# Altium project Extension board.PrjPcb
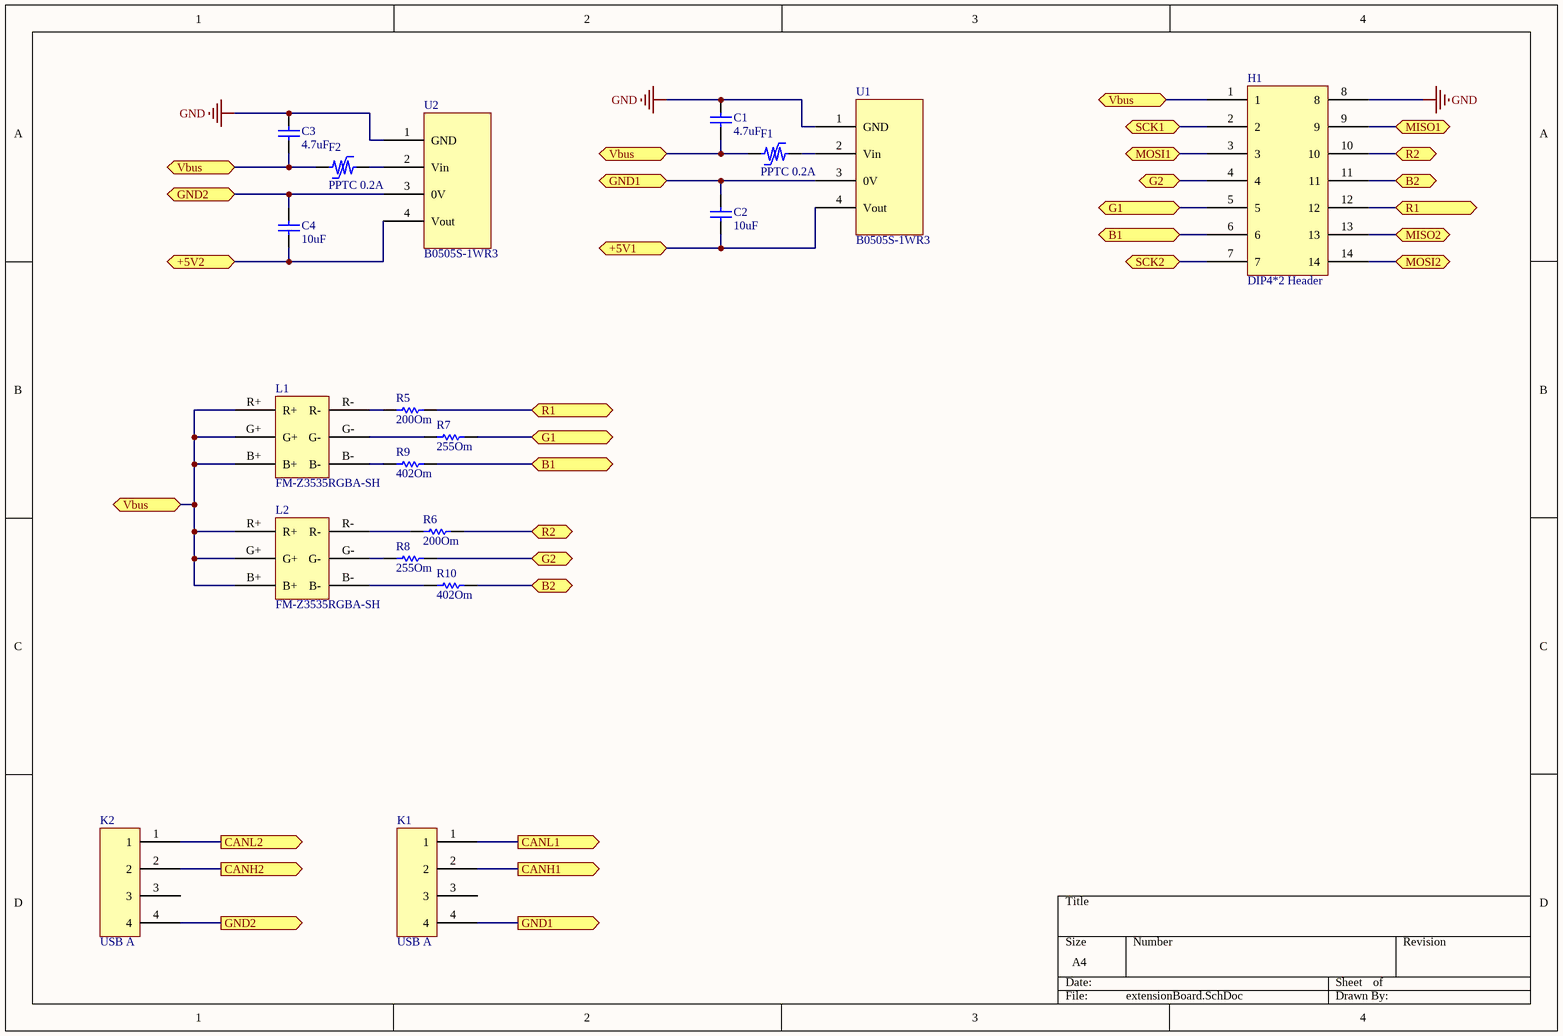
[diagram p0: extensionBoard.SchDoc]
2 sheets, 35 parts. Net scope: flat (ports and power ports of the same name join across sheets).
Board file: board.PcbDoc
Sheets:
  extensionBoard.SchDoc
  logic.SchDoc

## Sheet extensionBoard.SchDoc
size A4

### Parts
C1  4.7uF  [CAPC1608X90X35ML10T15]
C2  10uF  [CAPC1608X90X35ML10T15]
C3  4.7uF  [CAPC1608X90X35ML10T15]
C4  10uF  [CAPC1608X90X35ML10T15]
F1  PPTC 0.2A  [PTC 0603]
F2  PPTC 0.2A  [PTC 0603]
H1  DIP4*2 Header  [DIP7*2]
K1  USB A  [USB A]
K2  USB A  [USB A]
L1  FM-Z3535RGBA-SH  [Z3535RGBA]
L2  FM-Z3535RGBA-SH  [Z3535RGBA]
R5  200Om  [RESC1608X55X30ML20T10]
R6  200Om  [RESC1608X55X30ML20T10]
R7  255Om  [RESC1608X55X30ML20T10]
R8  255Om  [RESC1608X55X30ML20T10]
R9  402Om  [RESC1608X55X30ML20T10]
R10  402Om  [RESC1608X55X30ML20T10]
U1  B0505S-1WR3  [Dip4 package]
U2  B0505S-1WR3  [Dip4 package]

### Ports
+5V1 (bidir), +5V2 (bidir), B1 (bidir), B2 (bidir), CANH1 (out), CANH2 (out), CANL1 (out), CANL2 (out), G1 (bidir), G2 (bidir), GND1 (bidir), GND1 (out), GND2 (bidir), GND2 (out), MISO1 (bidir), MISO2 (bidir), MOSI1 (bidir), MOSI2 (bidir), R1 (bidir), R2 (bidir), SCK1 (bidir), SCK2 (bidir), Vbus (bidir)

### Nets
GND: C1.2 C3.2 H1.8 U1.1(GND) U2.1(GND)
NetC1_1: C1.1 C3.1 F1.1 F2.1 H1.1 L1.B+ L1.G+ L1.R+ L2.B+ L2.G+ L2.R+ ; port Vbus
NetC2_1: C2.1 U1.4(Vout) ; port +5V1
NetC2_2: C2.2 K1.4 U1.3(0V) ; port GND1
NetC4_1: C4.1 U2.4(Vout) ; port +5V2
NetC4_2: C4.2 K2.4 U2.3(0V) ; port GND2
NetF1_2: F1.2 U1.2(Vin)
NetF2_2: F2.2 U2.2(Vin)
NetH1_2: H1.2 ; port SCK1
NetH1_3: H1.3 ; port MOSI1
NetH1_4: H1.4 R8.2 ; port G2
NetH1_5: H1.5 R7.2 ; port G1
NetH1_6: H1.6 R9.2 ; port B1
NetH1_7: H1.7 ; port SCK2
NetH1_9: H1.9 ; port MISO1
NetH1_10: H1.10 R6.2 ; port R2
NetH1_11: H1.11 R10.2 ; port B2
NetH1_12: H1.12 R5.2 ; port R1
NetH1_13: H1.13 ; port MISO2
NetH1_14: H1.14 ; port MOSI2
NetK1_1: K1.1 ; port CANL1
NetK1_2: K1.2 ; port CANH1
NetK2_1: K2.1 ; port CANL2
NetK2_2: K2.2 ; port CANH2
NetL1_B-: L1.B- R9.1
NetL1_G-: L1.G- R7.1
NetL1_R-: L1.R- R5.1
NetL2_B-: L2.B- R10.1
NetL2_G-: L2.G- R8.1
NetL2_R-: L2.R- R6.1

Not connected (* = marked no-connect by the designer): K1 3; K2 3

### Library data of the parts
C1-C4 = CMP-2006-02335-1: Manufacturer: Murata; Part Number: GCM1885C2A101JA16D
F1 F2 = PTC Resettable Fuse
R5-R10 = CMP-2000-01555-1: Part Number: RK73H1JTTD5101F; Manufacturer: KOA Speer
L1 L2 = FM-Z3535RGBA-SH: ComponentLink1Description: New link; ComponentLink1URL: https://lcsc.com/product-detail/Light-Emitting-Diodes-LED_SMDLED-120-480mcd_C110903.html
U1 U2 = B0505S-1WR3: ComponentLink1Description: New link; ComponentLink1URL: https://lcsc.com/product-detail/Power-Modules_B0505S-1WR3_C131038.html

## Sheet logic.SchDoc
size A4
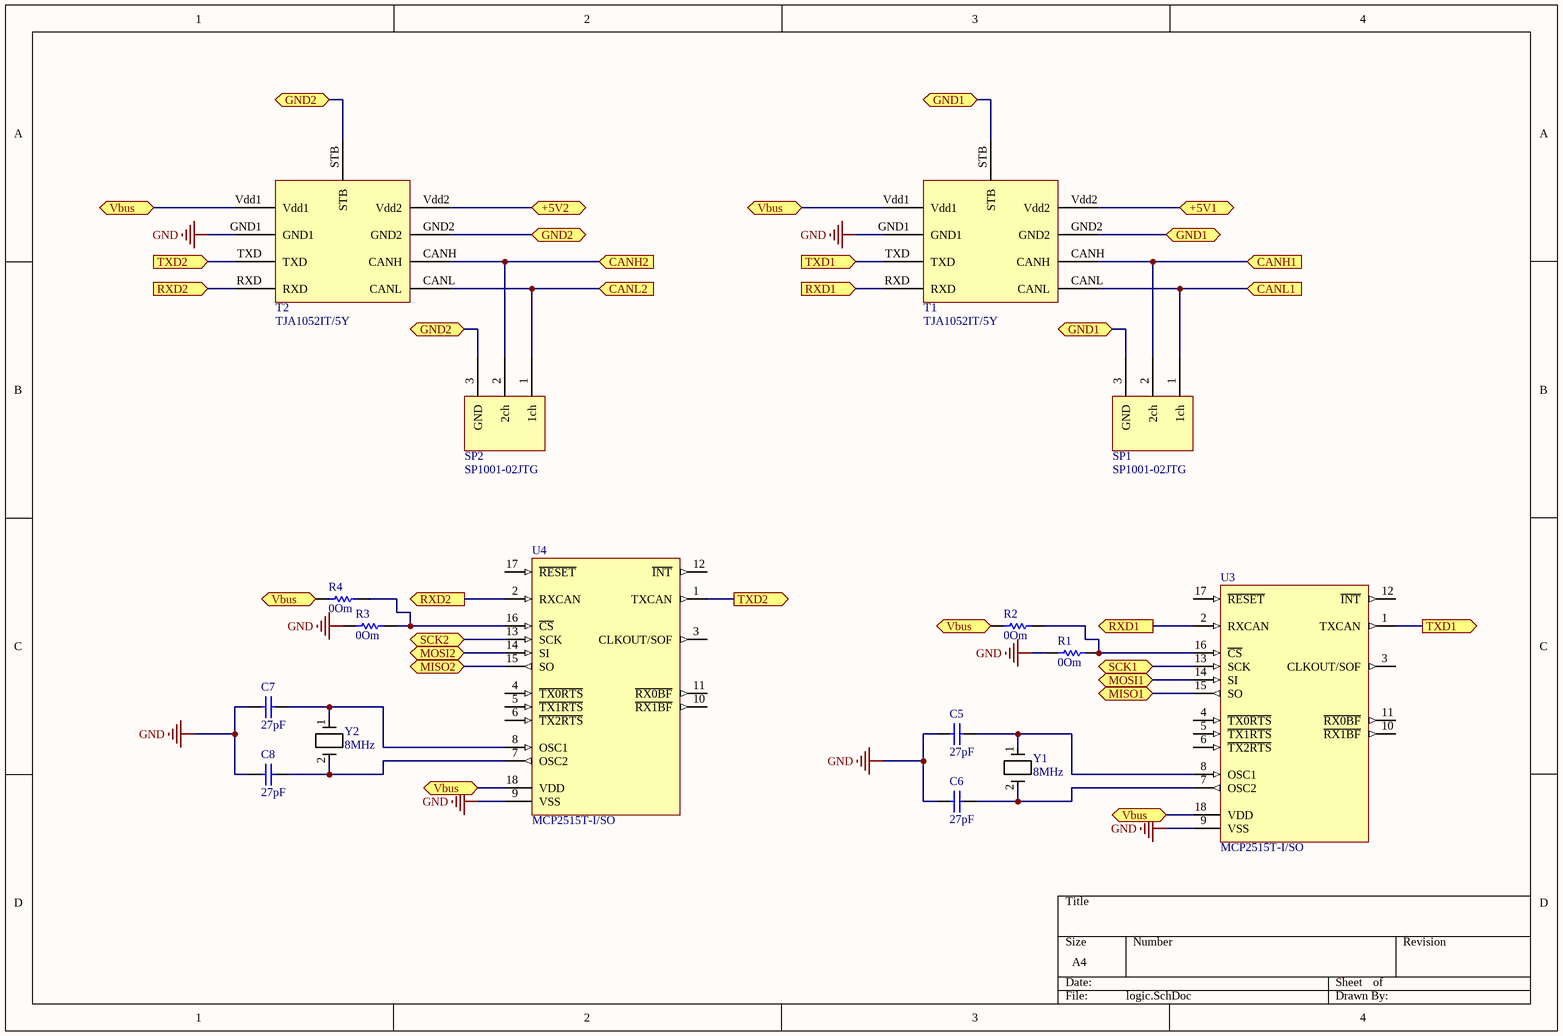
[diagram p1: logic.SchDoc]

### Parts
C5  27pF  [CAPC1608X90X35ML10T15]
C6  27pF  [CAPC1608X90X35ML10T15]
C7  27pF  [CAPC1608X90X35ML10T15]
C8  27pF  [CAPC1608X90X35ML10T15]
R1  0Om  [RESC1608X55X30ML20T10]
R2  0Om  [RESC1608X55X30ML20T10]
R3  0Om  [RESC1608X55X30ML20T10]
R4  0Om  [RESC1608X55X30ML20T10]
SP1  SP1001-02JTG  [SC70-3]
SP2  SP1001-02JTG  [SC70-3]
T1  TJA1052IT/5Y  [TJA1052]
T2  TJA1052IT/5Y  [TJA1052]
U3  MCP2515T-I/SO  [SOIC-SO18_N]
U4  MCP2515T-I/SO  [SOIC-SO18_N]
Y1  8MHz  [SMD-5032_2P]
Y2  8MHz  [SMD-5032_2P]

### Ports
+5V1 (bidir), +5V2 (bidir), CANH1 (in), CANH2 (in), CANL1 (in), CANL2 (in), GND1 (bidir), GND2 (bidir), MISO1 (bidir), MISO2 (bidir), MOSI1 (bidir), MOSI2 (bidir), RXD1 (in), RXD1 (out), RXD2 (in), RXD2 (out), SCK1 (bidir), SCK2 (bidir), TXD1 (in), TXD1 (out), TXD2 (in), TXD2 (out), Vbus (bidir)

### Nets
GND: C5.1 C6.1 C7.1 C8.1 R1.1 R3.1 T1.GND1 T2.GND1 U3.9(VSS) U4.9(VSS)
NetC1_1: R2.1 R4.1 T1.Vdd1 T2.Vdd1 U3.18(VDD) U4.18(VDD) ; port Vbus
NetC2_1: T1.Vdd2 ; port +5V1
NetC2_2: SP1.3(GND) T1.GND2 T1.STB ; port GND1
NetC4_1: T2.Vdd2 ; port +5V2
NetC4_2: SP2.3(GND) T2.GND2 T2.STB ; port GND2
NetC5_2: C5.2 U3.8(OSC1) Y1.1
NetC6_2: C6.2 U3.7(OSC2) Y1.2
NetC7_2: C7.2 U4.8(OSC1) Y2.1
NetC8_2: C8.2 U4.7(OSC2) Y2.2
NetH1_2: U3.13(SCK) ; port SCK1
NetH1_3: U3.14(SI) ; port MOSI1
NetH1_7: U4.13(SCK) ; port SCK2
NetH1_9: U3.15(SO) ; port MISO1
NetH1_13: U4.15(SO) ; port MISO2
NetH1_14: U4.14(SI) ; port MOSI2
NetK1_1: SP1.1(1ch) T1.CANL ; port CANL1
NetK1_2: SP1.2(2ch) T1.CANH ; port CANH1
NetK2_1: SP2.1(1ch) T2.CANL ; port CANL2
NetK2_2: SP2.2(2ch) T2.CANH ; port CANH2
NetR1_2: R1.2 R2.2 U3.16(~{CS})
NetR3_2: R3.2 R4.2 U4.16(~{CS})
NetT1_RXD: T1.RXD U3.2(RXCAN) ; port RXD1
NetT1_TXD: T1.TXD U3.1(TXCAN) ; port TXD1
NetT2_RXD: T2.RXD U4.2(RXCAN) ; port RXD2
NetT2_TXD: T2.TXD U4.1(TXCAN) ; port TXD2

Not connected (* = marked no-connect by the designer): U3 3(CLKOUT/SOF) 4(~{TX0RTS}) 5(~{TX1RTS}) 6(~{TX2RTS}) 10(~{RX1BF}) 11(~{RX0BF}) 12(~{INT}) 17(~{RESET}); U4 3(CLKOUT/SOF) 4(~{TX0RTS}) 5(~{TX1RTS}) 6(~{TX2RTS}) 10(~{RX1BF}) 11(~{RX0BF}) 12(~{INT}) 17(~{RESET})

### Library data of the parts
C5-C8 = CMP-2006-02335-1: as C1 on sheet extensionBoard
R1-R4 = CMP-2000-01555-1: as R5 on sheet extensionBoard
U3 U4 = CMP-0186-00139-2: Stand-Alone CAN Controller With SPI Interface, 18-Pin SOIC, Industrial Temperature, Tape and Reel; RevisionNote: URLs added. DatasheetVersion updated.; ComponentLink1Description: Manufacturer URL; Code_JEDEC: MS-013; ComponentLink2URL: http://ww1.microchip.com/downloads/en/DeviceDoc/21801f.pdf; ComponentLink3Description: Package Specification; PackageVersion: revBB, Aug-2009; PackageReference: SOIC-SO18; ComponentLink2Description: Datasheet; DatasheetVersion: revF, Oct-2010; PackageDescription: 18-Lead Plastic Small Outline (SO) - Wide 7.50mm Body [SOIC]; ComponentLink1URL: http://www.microchip.com/; ComponentLink3URL: http://www.microchip.com/stellent/groups/techpub_sg/documents/packagingspec/en012702.pdf
Y1 Y2 = SMD-5032_2P resonator
T1 T2 = TJA1052IT/5Y: ComponentLink1Description: New link; ComponentLink1URL: https://lcsc.com/product-detail/CAN-ICs_NXP-Semicon_TJA1052IT-5Y_NXP-Semicon-TJA1052IT-5Y_C92210.html

## Nets that join several sheets
GND: extensionBoard (5 pins), logic (10 pins)
NetC1_1: extensionBoard (11 pins), logic (6 pins)
NetC2_1: extensionBoard (C2.1 U1.4), logic (T1.Vdd2)
NetC2_2: extensionBoard (C2.2 K1.4 U1.3), logic (SP1.3 T1.GND2 T1.STB)
NetC4_1: extensionBoard (C4.1 U2.4), logic (T2.Vdd2)
NetC4_2: extensionBoard (C4.2 K2.4 U2.3), logic (SP2.3 T2.GND2 T2.STB)
NetH1_2: extensionBoard (H1.2), logic (U3.13)
NetH1_3: extensionBoard (H1.3), logic (U3.14)
NetH1_7: extensionBoard (H1.7), logic (U4.13)
NetH1_9: extensionBoard (H1.9), logic (U3.15)
NetH1_13: extensionBoard (H1.13), logic (U4.15)
NetH1_14: extensionBoard (H1.14), logic (U4.14)
NetK1_1: extensionBoard (K1.1), logic (SP1.1 T1.CANL)
NetK1_2: extensionBoard (K1.2), logic (SP1.2 T1.CANH)
NetK2_1: extensionBoard (K2.1), logic (SP2.1 T2.CANL)
NetK2_2: extensionBoard (K2.2), logic (SP2.2 T2.CANH)